# EAGLE design zeta2rework_lw_v9 (EAGLE 9.0.1)
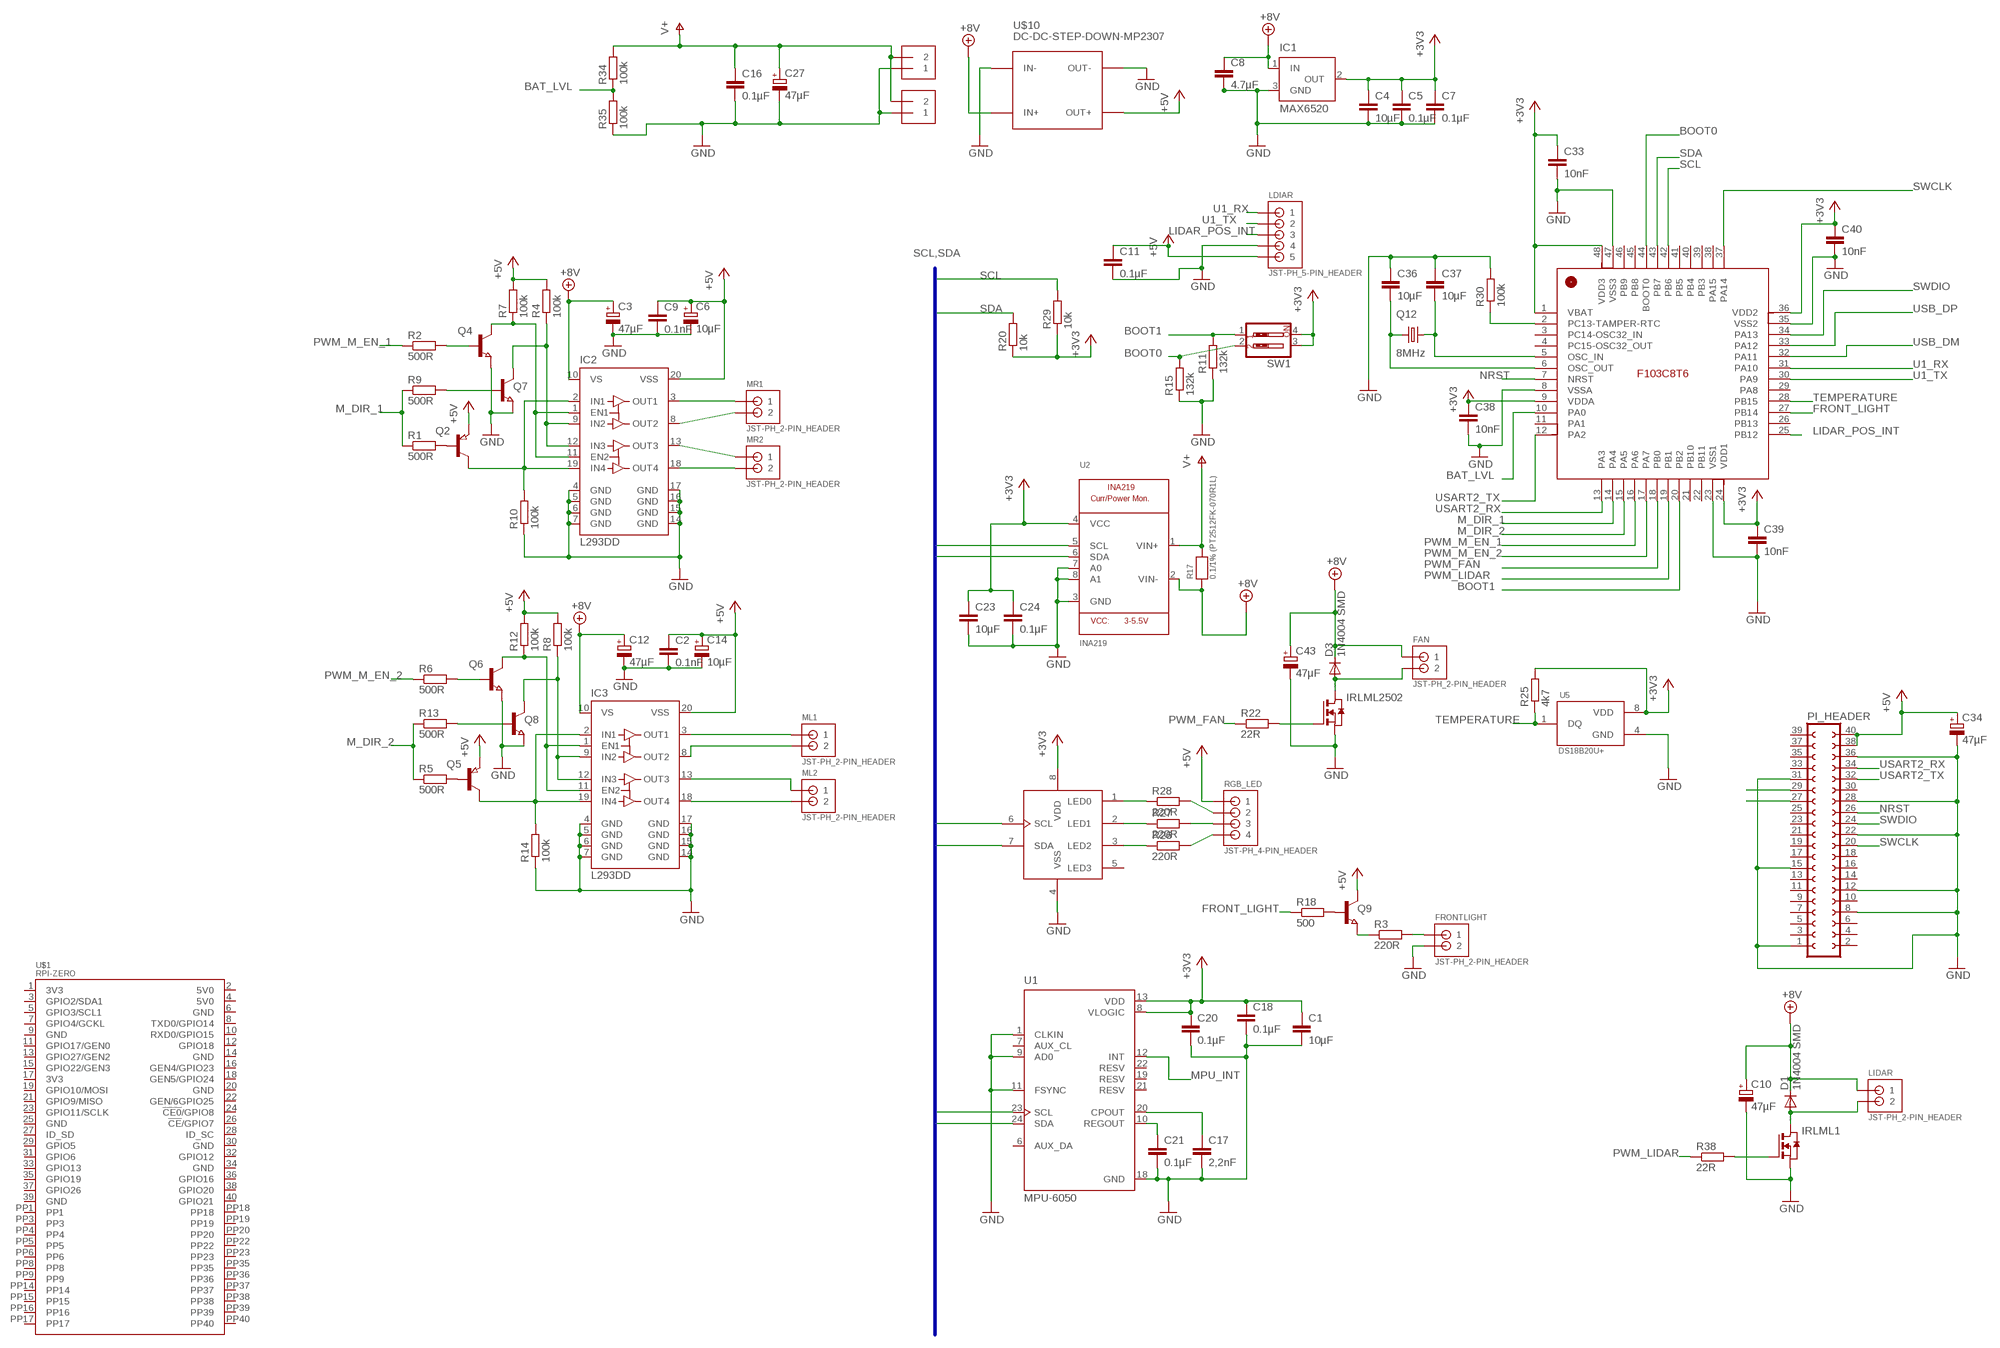
[diagram p0: schematic, sheet 1]

## Parts
C1  10µF  C-EUC1206  [C1206]
C2  0.1nF  C-EUC1206  [C1206]
C3  47µF  CPOL-EUUD-4X5,8  [UD-4X5,8_NICHICON]
C4  10µF  C-EUC1206  [C1206]
C5  0.1µF  C-EUC1206  [C1206]
C6  10µF  CPOL-EUUD-4X5,8  [UD-4X5,8_NICHICON]
C7  0.1µF  C-EUC1206  [C1206]
C8  4.7µF  C-EUC1206  [C1206]
C9  0.1nF  C-EUC1206  [C1206]
C10  47µF  CPOL-EUUD-4X5,8  [UD-4X5,8_NICHICON]
C11  0.1µF  C-EUC1206  [C1206]
C12  47µF  CPOL-EUUD-4X5,8  [UD-4X5,8_NICHICON]
C14  10µF  CPOL-EUUD-4X5,8  [UD-4X5,8_NICHICON]
C16  0.1µF  C-EUC1206  [C1206]
C17  2,2nF  C-EUC1206  [C1206]
C18  0.1µF  C-EUC1206  [C1206]
C20  0.1µF  C-EUC1206  [C1206]
C21  0.1µF  C-EUC1206  [C1206]
C23  10µF  C-EUC1206  [C1206]
C24  0.1µF  C-EUC1206  [C1206]
C27  47µF  CPOL-EUUD-4X5,8  [UD-4X5,8_NICHICON]
C33  10nF  C-EUC1206  [C1206]
C34  47µF  CPOL-EUUD-4X5,8  [UD-4X5,8_NICHICON]
C36  10µF  C-EUC1206  [C1206]
C37  10µF  C-EUC1206  [C1206]
C38  10nF  C-EUC1206  [C1206]
C39  10nF  C-EUC1206  [C1206]
C40  10nF  C-EUC1206  [C1206]
C43  47µF  CPOL-EUUD-4X5,8  [UD-4X5,8_NICHICON]
D1  1N4004 SMD  DIODE-DO214AC  [DO214AC]
D3  1N4004 SMD  DIODE-DO214AC  [DO214AC]
FAN  JST-PH_2-PIN_HEADER  [JST_B2B-PH_HEADER]
FRONTLIGHT  JST-PH_2-PIN_HEADER  [JST_B2B-PH_HEADER]
IC1  MAX6520  [SOT23]
IC2  L293DD  [SO20]
IC3  L293DD  [SO20]
IRLML1  NMOSSOT23  [SOT-23]
IRLML2502  NMOSSOT23  [SOT-23]
LDIAR  JST-PH_5-PIN_HEADER  [JST_B5B-PH_HEADER]
LIDAR  JST-PH_2-PIN_HEADER  [JST_B2B-PH_HEADER]
ML1  JST-PH_2-PIN_HEADER  [JST_B2B-PH_HEADER]
ML2  JST-PH_2-PIN_HEADER  [JST_B2B-PH_HEADER]
MR1  JST-PH_2-PIN_HEADER  [JST_B2B-PH_HEADER]
MR2  JST-PH_2-PIN_HEADER  [JST_B2B-PH_HEADER]
PCA9533  PCA9533  [SOIC8]
PI_HEADER  FE20-2  [FE20-2]
Q2  PNP-TRANSISTOR_SOT23  [SOT23]
Q4  NPN-TRANSISTOR_SOT23  [SOT23]
Q5  PNP-TRANSISTOR_SOT23  [SOT23]
Q6  NPN-TRANSISTOR_SOT23  [SOT23]
Q7  NPN-TRANSISTOR_SOT23  [SOT23]
Q8  NPN-TRANSISTOR_SOT23  [SOT23]
Q9  NPN-TRANSISTOR_SOT23  [SOT23]
Q12  8MHz  KX-13  [7.0X5.0]
R1  500R  R-EU_R0603  [R0603]
R2  500R  R-EU_R0603  [R0603]
R3  220R  R-EU_R0603  [R0603]
R4  100k  R-EU_R0603  [R0603]
R5  500R  R-EU_R0603  [R0603]
R6  500R  R-EU_R0603  [R0603]
R7  100k  R-EU_R0603  [R0603]
R8  100k  R-EU_R0603  [R0603]
R9  500R  R-EU_R0603  [R0603]
R10  100k  R-EU_R0603  [R0603]
R11  132k  R-EU_R0603  [R0603]
R12  100k  R-EU_R0603  [R0603]
R13  500R  R-EU_R0603  [R0603]
R14  100k  R-EU_R0603  [R0603]
R15  132k  R-EU_R0603  [R0603]
R17  0.1/1% (PT2512FK-070R1L)  RESISTOR2512  [2512]
R18  500  R-EU_R1206  [R1206]
R20  10k  R-EU_R0603  [R0603]
R22  22R  R-EU_R0603  [R0603]
R25  4k7  R-EU_R0603  [R0603]
R26  220R  R-EU_R0603  [R0603]
R27  220R  R-EU_R0603  [R0603]
R28  220R  R-EU_R0603  [R0603]
R29  10k  R-EU_R0603  [R0603]
R30  100k  R-EU_R0603  [R0603]
R34  100k  R-EU_R0603  [R0603]
R35  100k  R-EU_R0603  [R0603]
R38  22R  R-EU_R0603  [R0603]
RGB_LED  JST-PH_4-PIN_HEADER  [JST_B4B-PH_HEADER]
STM32F103CB  STM32F103CB  STM32F103C8T6  [LQFP48_7X7MM_0.5MMPP]
SUPPLY_IN  TERMBLOCK_1X2-3.5MM  [1X2-3.5MM]
SUPPLY_IN1  TERMBLOCK_1X2-3.5MM  [1X2-3.5MM]
SW1  SW_DIP-2  [EDG-02]
U1  MPU-6050  [QFN50P400X400X95-24N]
U2  INA219  [SOT23-8]
U5  DS18B20U+  [SOP65P490X95-8N]
U$1  RPI-ZERO  [RASP_PI_ZERO_BOARD_FULL]
U$10  DC-DC-STEP-DOWN-MP2307  [DC-DC-STEP-DOWN-MP2307]

## Nets
+3V3: C1.1 C4.1 C5.1 C7.1 C18.1 C20.1 C23.1 C24.1 C33.1 C38.1 C39.1 C40.1 IC1.2(OUT) PCA9533.8(VDD) R20.1 R25.2 R29.1 STM32F103CB.1(VBAT) STM32F103CB.9(VDDA) STM32F103CB.24(VDD1) STM32F103CB.36(VDD2) STM32F103CB.48(VDD3) SW1.3 SW1.4 U1.8(VLOGIC) U1.13(VDD) U2.4(VCC) U5.8(VDD)
+5V: C2.1 C6.+ C9.1 C11.1 C14.+ C34.+ IC2.20(VSS) IC3.20(VSS) LDIAR.P5 PI_HEADER.38 PI_HEADER.40 Q2.2(E) Q5.2(E) Q9.3(C) R4.2 R7.2 R8.2 R12.2 RGB_LED.P1 U$10.OUT+
+8V: C3.+ C8.1 C10.+ C12.+ C43.+ D1.C D3.C FAN.P1 IC1.1(IN) IC2.10(VS) IC3.10(VS) LIDAR.P1 R17.1 U2.2(VIN-) U$10.IN+
BAT_LVL: R34.1 R35.2 STM32F103CB.10(PA0)
BOOT0: R15.2 STM32F103CB.44(BOOT0) SW1.2
BOOT1: R11.2 STM32F103CB.20(PB2) SW1.1
BOOT2: PI_HEADER.29
BOOT3: PI_HEADER.27
FRONT_LIGHT: R18.1 STM32F103CB.27(PB14)
GND: C1.2 C2.2 C3.- C4.2 C5.2 C6.- C7.2 C8.2 C9.2 C10.- C11.2 C12.- C14.- C16.2 C17.2 C18.2 C20.2 C21.2 C23.2 C24.2 C27.- C33.2 C34.- C36.1 C37.1 C38.2 C39.2 C40.2 C43.- FRONTLIGHT.P2 IC1.3(GND) IC2.4(GND) IC2.5(GND) IC2.6(GND) IC2.7(GND) IC2.14(GND) IC2.15(GND) IC2.16(GND) IC2.17(GND) IC3.4(GND) IC3.5(GND) IC3.6(GND) IC3.7(GND) IC3.14(GND) IC3.15(GND) IC3.16(GND) IC3.17(GND) IRLML1.2(S) IRLML2502.2(S) LDIAR.P4 PCA9533.4(VSS) PI_HEADER.1 PI_HEADER.8 PI_HEADER.12 PI_HEADER.15 PI_HEADER.22 PI_HEADER.28 PI_HEADER.31 PI_HEADER.36 Q4.2(E) Q6.2(E) Q7.2(E) Q8.2(E) R10.1 R11.1 R14.1 R15.1 R30.2 R35.1 STM32F103CB.8(VSSA) STM32F103CB.23(VSS1) STM32F103CB.35(VSS2) STM32F103CB.47(VSS3) SUPPLY_IN1.1 SUPPLY_IN.1 U1.1(CLKIN) U1.9(AD0) U1.11(FSYNC) U1.18(GND) U2.3(GND) U2.7(A0) U2.8(A1) U5.4(GND) U$10.IN- U$10.OUT-
LIDAR_POS_INT: LDIAR.P3 STM32F103CB.25(PB12)
M_DIR_1: R1.1 R9.1 STM32F103CB.14(PA4)
M_DIR_2: R5.1 R13.1 STM32F103CB.15(PA5)
MPU_INT: U1.12(INT)
N$1: IC2.9(IN2) IC2.12(IN3) Q7.3(C) R4.1
N$2: IC3.18(OUT4) ML2.P2
N$3: IC3.13(OUT3) ML2.P1
N$4: IC2.18(OUT4) MR2.P2
N$5: IC2.2(IN1) IC2.19(IN4) Q2.3(C) R10.2
N$6: IC3.9(IN2) IC3.12(IN3) Q8.3(C) R8.1
N$7: IC3.2(IN1) IC3.19(IN4) Q5.3(C) R14.2
N$8: IC2.1(EN1) IC2.11(EN2) Q4.3(C) R7.1
N$9: IC3.1(EN1) IC3.11(EN2) Q6.3(C) R12.1
N$10: Q2.1(B) R1.2
N$11: Q4.1(B) R2.2
N$12: Q7.1(B) R9.2
N$13: Q5.1(B) R5.2
N$14: Q6.1(B) R6.2
N$15: Q8.1(B) R13.2
N$16: IC2.13(OUT3) MR2.P1
N$17: IC2.8(OUT2) MR1.P2
N$18: IC2.3(OUT1) MR1.P1
N$19: Q9.1(B) R18.2
N$22: PCA9533.3(LED2) R26.1
N$23: PCA9533.2(LED1) R27.1
N$24: PCA9533.1(LED0) R28.1
N$25: IC3.8(OUT2) ML1.P2
N$26: IC3.3(OUT1) ML1.P1
N$27: Q9.2(E) R3.1
N$28: FRONTLIGHT.P1 R3.2
N$31: R26.2 RGB_LED.P4
N$33: R27.2 RGB_LED.P3
N$34: C17.1 U1.20(CPOUT)
N$35: R28.2 RGB_LED.P2
N$36: C21.1 U1.10(REGOUT)
N$37: IRLML2502.3(G) R22.2
N$38: IRLML1.3(G) R38.2
N$39: D1.A IRLML1.1(D) LIDAR.P2
N$46: C36.2 Q12.1 STM32F103CB.6(OSC_OUT)
N$47: C37.2 Q12.3 STM32F103CB.5(OSC_IN)
N$49: R30.1 STM32F103CB.2(PC13-TAMPER-RTC)
N$55: D3.A FAN.P2 IRLML2502.1(D)
NRST: PI_HEADER.26 STM32F103CB.7(NRST)
PWM_FAN: R22.1 STM32F103CB.18(PB0)
PWM_LIDAR: R38.1 STM32F103CB.19(PB1)
PWM_M_EN_1: R2.1 STM32F103CB.16(PA6)
PWM_M_EN_2: R6.1 STM32F103CB.17(PA7)
SCL: PCA9533.6(SCL) R29.2 STM32F103CB.42(PB6) U1.23(SCL) U2.5(SCL)
SDA: PCA9533.7(SDA) R20.2 STM32F103CB.43(PB7) U1.24(SDA) U2.6(SDA)
SWCLK: PI_HEADER.20 STM32F103CB.37(PA14)
SWDIO: PI_HEADER.24 STM32F103CB.34(PA13)
TEMPERATURE: R25.1 STM32F103CB.28(PB15) U5.1(DQ)
U1_RX: LDIAR.P1 STM32F103CB.31(PA10)
U1_TX: LDIAR.P2 STM32F103CB.30(PA9)
USART2_RX: PI_HEADER.34 STM32F103CB.13(PA3)
USART2_TX: PI_HEADER.32 STM32F103CB.12(PA2)
USB_DM: STM32F103CB.32(PA11)
USB_DP: STM32F103CB.33(PA12)
V+: C16.1 C27.+ R17.2 R34.2 SUPPLY_IN1.2 SUPPLY_IN.2 U2.1(VIN+)
Unconnected: PCA9533.5(LED3) PI_HEADER.2 PI_HEADER.3 PI_HEADER.4 PI_HEADER.5 PI_HEADER.6 PI_HEADER.7 PI_HEADER.9 PI_HEADER.10 PI_HEADER.11 PI_HEADER.13 PI_HEADER.14 PI_HEADER.16 PI_HEADER.17 PI_HEADER.18 PI_HEADER.19 PI_HEADER.21 PI_HEADER.23 PI_HEADER.25 PI_HEADER.30 PI_HEADER.33 PI_HEADER.35 PI_HEADER.37 PI_HEADER.39 STM32F103CB.3(PC14-OSC32_IN) STM32F103CB.4(PC15-OSC32_OUT) STM32F103CB.11(PA1) STM32F103CB.21(PB10) STM32F103CB.22(PB11) STM32F103CB.26(PB13) STM32F103CB.29(PA8) STM32F103CB.38(PA15) STM32F103CB.39(PB3) STM32F103CB.40(PB4) STM32F103CB.41(PB5) STM32F103CB.45(PB8) STM32F103CB.46(PB9) U1.6(AUX_DA) U1.7(AUX_CL) U1.19(RESV) U1.21(RESV) U1.22(RESV) U$1.1(3V3) U$1.2(5V0) U$1.3(GPIO2/SDA1) U$1.4(5V0) U$1.5(GPIO3/SCL1) U$1.6(GND) U$1.7(GPIO4/GCKL) U$1.8(TXD0/GPIO14) U$1.9(GND) U$1.10(RXD0/GPIO15) U$1.11(GPIO17/GEN0) U$1.12(GPIO18) U$1.13(GPIO27/GEN2) U$1.14(GND) U$1.15(GPIO22/GEN3) U$1.16(GEN4/GPIO23) U$1.17(3V3) U$1.18(GEN5/GPIO24) U$1.19(GPIO10/MOSI) U$1.20(GND) U$1.21(GPIO9/MISO) U$1.22(GEN/6GPIO25) U$1.23(GPIO11/SCLK) U$1.24(!CE0!/GPIO8) U$1.25(GND) U$1.26(!CE!/GPIO7) U$1.27(ID_SD) U$1.28(ID_SC) U$1.29(GPIO5) U$1.30(GND) U$1.31(GPIO6) U$1.32(GPIO12) U$1.33(GPIO13) U$1.34(GND) U$1.35(GPIO19) U$1.36(GPIO16) U$1.37(GPIO26) U$1.38(GPIO20) U$1.39(GND) U$1.40(GPIO21) U$1.PP1 U$1.PP3 U$1.PP4 U$1.PP5 U$1.PP6 U$1.PP8 U$1.PP9 U$1.PP14 U$1.PP15 U$1.PP16 U$1.PP17 U$1.PP18 U$1.PP19 U$1.PP20 U$1.PP22 U$1.PP23 U$1.PP35 U$1.PP36 U$1.PP37 U$1.PP38 U$1.PP39 U$1.PP40

## Buses
SCL,SDA

## Library data of the parts
C1 C2 C4 C5 C7-C9 C11 C16-C18 C20 C21 C23 C24 C33 C36-C40 = rcl:C-EU: CAPACITOR, European symbol; SPICEPREFIX: C
C3 C6 C10 C12 C14 C27 C34 C43 = rcl:CPOL-EU: POLARIZED CAPACITOR, European symbol; SPICEPREFIX: C
D1 D3 = diode:DIODE-: DIODE
FAN FRONTLIGHT LIDAR ML1 ML2 MR1 MR2 = srg:JST-PH_2-PIN_HEADER: 2-pin JST PH Shrouded Header, top entry P/N B2B-PH-K-S Mating connector PHR-2 Mating cable assembly: Sparkfun PRT-09914 <http://www.sparkfun.com/products/9914>
IC1 = maxim:MAX6520: 1.2V Voltage Reference 50ppm/°C, SOT23, 3-Terminal Source: Data sheet <http://datasheets.maxim-ic.com/en/ds/MAX6520.pdf>; MF: MAXIM; MPN: MAX6520EUR-T; OC_FARNELL: unknown; OC_NEWARK: 02J4586
IC2 IC3 = st-microelectronics:L293DD: PUSH-PULL FOUR CHANNEL DRIVER WITH DIODES Source: http://www.st.com/stonline/books/pdf/docs/1330.pdf; OC_FARNELL: unknown
IRLML1 IRLML2502 = zetex:NMOSSOT23: MOS FET; OC_FARNELL: unknown; OC_NEWARK: unknown
LDIAR = srg:JST-PH_5-PIN_HEADER: 5-pin JST PH Shrouded Header, top entry P/N B5B-PH-K-S Mating connector PHR-5 Mating cable assembly: Sparkfun PRT-09917 <http://www.sparkfun.com/products/9917>
PCA9533 = adam - ics:PCA9533: PCA9533D/01: LED driver and dimmer 4 channel, PWM @ 8 bit resolution 25mA / channel sink external resistors per LED I2C protocol @ 400kHz (fast) digikey: 568-3372-5-ND, 8-SOIC, $1.92
PI_HEADER = con-lsta:FE20-2: FEMALE HEADER; OC_FARNELL: unknown; OC_NEWARK: unknown
Q2 Q5 = semicon-smd-ipc:PNP-TRANSISTOR_: PNP TRANSISTOR
Q4 Q6-Q9 = semicon-smd-ipc:NPN-TRANSISTOR_: NPN TRANSISTOR
Q12 = crystal-geyer_V1_0:KX: Quartz Crystals (MHz) SMD: KX - Serie Model Size l/w/h [mm] Frequency Range Frequency Stability Temp. Range [°C] Load Capacitance AECQ 200 availabel Datasheet KX-4 KX-5 KX-6 KX-7 KX-9A KX-9B KX-12A KX-12B KX-13 KX-20 KX-K KX-KS 1.6/1.2/0.3 2.0/1.6/0.45 2.5/2.0/0.55 3.2/2.5/0.8 5.0/3.2/1.0 5.0/3.2/1.1 6.0/3.5/1.1 6.0/3.5/1.0 7.0/5.0 /1.3 11.6/5.5/1.6 12.3/4.5/4.2 12.3/4.5/3.2 24.0 ~ 80.0 MHz 16.0 ~ 80.0 MHz 12.0 ~ 80.0 MHz 8.0 ~ 60.0 MHz 7,68 ~ 300,0 MHz 8,0 ~ 50,0 MHz 8,0 ~ 150,0 MHz 8,0 ~ 50,0 MHz 6,0 ~ 160,0 MHz 3,579 ~ 25,0 MHz 3,579 ~ 70,0 MHz 3,579 ~ 70,0 MHz ±10 … ±50ppm ±10 … ±50ppm ±10 … ±50ppm ±10 … ±50ppm ±10 … ±50ppm ±10 … ±50ppm ±10 … ±50ppm ±10 … ±50ppm ±10 … ±50ppm ±50ppm ±10 … ±50ppm ±10 … ±50ppm (*) -40°C …+85°C (*) -40°C …+125°C (*) -40°C …+125°C (*) -40°C …+125°C (*) -40°C …+105°C (*) -40°C …+105°C (*) -40°C …+125°C (*) -40°C …+105°C (*) -40°C …+105°C (*) -40°C …+105°C (*) -40°C …+85°C (*) -40°C …+85°C 8, 8…16 8, 8…16 10, 8…16 12, 7…20 16, 10…20 16, 10…20 16, 10…20 16, 12…20 16, 12…20 16, 12…20 16, 12…30 16, 12…30 - yes yes yes - - - - - - - - KX-4.pdf <http://www.geyer-electronic.de/uploads/tx_userartikelfrequenz/GEYER-KX-4.pdf> KX-5.pdf <http://www.geyer-electronic.de/uploads/tx_userartikelfrequenz/GEYER-KX-5.pdf> KX-6.pdf <http://www.geyer-electronic.de/uploads/tx_userartikelfrequenz/GEYER-KX-6.pdf> KX-7.pdf <http://www.geyer-electronic.de/uploads/tx_userartikelfrequenz/GEYER-KX-7.pdf> KX-9A.pdf <http://www.geyer-electronic.de/uploads/tx_userartikelfrequenz/GEYER-KX-9A.pdf> KX-9B.pdf <http://www.geyer-electronic.de/uploads/tx_userartikelfrequenz/GEYER-KX-9B.pdf> KX-12A.pdf <http://www.geyer-electronic.de/uploads/tx_userartikelfrequenz/GEYER-KX-12A.pdf> KX-12B.pdf <http://www.geyer-electronic.de/uploads/tx_userartikelfrequenz/GEYER-KX-12B.pdf> KX-13.pdf <http://www.geyer-electronic.de/uploads/tx_userartikelfrequenz/GEYER-KX-13.pdf> KX-20.pdf <http://www.geyer-electronic.de/uploads/tx_userartikelfrequenz/GEYER-KX-20.pdf> KX-K.pdf <http://www.geyer-electronic.de/uploads/tx_userartikelfrequenz/GEYER-KX-K.pdf> KX-KS.pdf <http://www.geyer-electronic.de/uploads/tx_userartikelfrequenz/GEYER-KX-KS.pdf> <http://www.geyer-electronic.de/fileadmin/template/img/logo-geyer-electronic.png> Details see: http://www.geyer-electronic.de/Frequenz-Produkte.9.0.html Created 2016-06-07, Hans Locher 2016 (C) Geyer Quartz Technology KX4,KX5,KX6,KX7,KX9A,KX9B,KX12A,KX12B,KX13,KX20,KXK,KXKS;1612;2016;2520;3225;5032;6035;7050;11655;12345;1,6x1,2;2,0x1,6;2,5x2,0;3,2x2,5;5,0x3,2;6,0x3,5;7,0x5,0;11,6x5,5;12,3x4,5;12,3x4,5;1.6x1.2;2.0x1.6;2.5x2.0;3.2x2.5;5.0x3.2;6.0x3.5;7.0x5.0;11.6x5.5;12.3x4.5;12.3x4.5;
R1-R15 R18 R20 R22 R25-R30 R34 R35 R38 = rcl:R-EU_: RESISTOR, European symbol; SPICEPREFIX: R
R17 = microbuilder:RESISTOR: Resistors 0402 - 0402 Surface Mount Package 22 Ohm 1% 1/16W [Digikey: 311-22.0LRTR-ND] 33 Ohm 5% 1/16W 1.0K 5% 1/16W 1.5K 5% 1/16W 2.0K 1% 1/16W 10.0K 1% 1/16W [Digikey: 311-10.0KLRTR-ND] 10.0K 5% 1/16W [Digikey: RMCF0402JT10K0TR-ND] 12.1K 1% 1/16W [Digikey: 311-22.0LRTR-ND] 100.0K 5% 1/16W 0603 - 0603 Surface Mount Package 0 Ohm 1/10 Watt 1% Resistor 15 Ohm 1/10 Watt 1% Resistor 33 Ohm 1/10 Watt 1% Resistor 49.9 Ohm 1/10 Watt 1% Resistor 100 Ohm 1/10 Watt 1% Resistor 150 Ohm 1/10 Watt 1% Resistor 240 Ohm 1/10 Watt 1% Resistor 390 Ohm 1/10 Watt 1% Resistor 560 Ohm 1/10 Watt 1% Resistor 680 Ohm 1/10 Watt 1% Resistor 750 Ohm 1/10 Watt 1% Resistor 1.0K Ohm 1/10 Watt 1% Resistor 1.5K Ohm 1/10 Watt 1% Resistor 2.0K Ohm 1/10 Watt 1% Resistor 2.2K Ohm 1/10 Watt 1% Resistor 3.3K Ohm 1/10 Watt 1% Resistor 4.7K Ohm 1/10 Watt 1% Resistor 10.0K Ohm 1/10 Watt 1% Resistor 12.0K Ohm 1/10 Watt 1% Resistor 12.1K Ohm 1/10 Watt 1% Resistor 20.0K Ohm 1/10 Watt 1% Resistor 33.0K Ohm 1/10 Watt 1% Resistor 100.0K Ohm 1/10 Watt 1% Resistor 0805 - 0805 Surface Mount Package 0 Ohm 1/8 Watt 1% Resistor 33 Ohm 1/8 Watt 1% Resistor 100 Ohm 1/8 Watt 1% Resistor 150 Ohm 1/8 Watt 1% Resistor 200 Ohm 1/8 Watt 1% Resistor 240 Ohm 1/8 Watt 1% Resistor 330 Ohm 1/8 Watt 1% Resistor 390 Ohm 1/8 Watt 1% Resistor 470 Ohm 1/8 Watt 1% Resistor 1.0K Ohm 1/8 Watt 1% Resistor 1.5K Ohm 1/8 Watt 1% Resistor 2.0K Ohm 1/8 Watt 1% Resistor 4.7K Ohm 1/8 Watt 1% Resistor 5.1K Ohm 1/8 Watt 1% Resistor 5.6K Ohm 1/8 Watt 1% Resistor 10.0K Ohm 1/8 Watt 1% Resistor 22.0K Ohm 1/8 Watt 1% Resistor 33.0K Ohm 1/8 Watt 1% Resistor 100K Ohm 1/8 Watt 1% Resistor 1206 - 1206 Surface Mount Package 2012 - 2010 Surface Mount Package 0.11 Ohm 1/2 Watt 1% Resistor - Digikey: RHM.11UCT-ND
RGB_LED = srg:JST-PH_4-PIN_HEADER: 4-pin JST PH Shrouded Header, top entry P/N B4B-PH-K-S Mating connector PHR-4 Mating cable assembly: Sparkfun PRT-09916 <http://www.sparkfun.com/products/9916>
STM32F103CB = STM32F103C8T6:STM32F103C8T6; AVAILABILITY: Good; DESCRIPTION: Mainstream Performance line, ARM Cortex-M3 MCU with 64 Kbytes Flash, 72 MHz CPU, motor control, USB and CAN; MF: STMicroelectronics; MP: STM32F103C8T6; PACKAGE: LQFP-48 STMicroelectronics; PRICE: 3.83 USD
SUPPLY_IN SUPPLY_IN1 = microbuilder:TERMBLOCK_1X2: 3.5mm Terminal block http://www.ladyada.net/library/pcb/eaglelibrary.html
SW1 = special:SW_DIP-2: DIP SWITCH
U1 = MPU-6050:MPU-6050: MPU-6050 Six-Axis (Gyro + Accelerometer) MEMS MotionTracking™ Devices; AVAILABILITY: Good; DESCRIPTION: 3-axis gyroscope, 3-axis accelerometer in a 4x4x0.9 housing; MF: TDK; MP: MPU-6050; PACKAGE: QFN-24 InvenSense; PRICE: 5.12 USD
U2 = INA219:INA219: INA219 - I2C Current/Power Monitor Voltage Range: 0-26V Accuracy: 0.5% Temperature: -40°C - 125°C; AVAILABILITY: Unavailable; DESCRIPTION: the ina219 is a high-side current shunt and power monitor with an i2c interface. the ina219 monitors both shunt drop ...; MF: Texas Instruments; MP: INA219; PACKAGE: None; PRICE: None
U5 = DS18B20U_:DS18B20U+: Board Mount Temperature Sensors Prgmble Resolution 1-Wire Parasite Pwr; AVAILABILITY: Unavailable; DESCRIPTION: Date Code: 1043+; RoHS Compliant: Yes;; MF: Maxim; MP: DS18B20U+; PACKAGE: TSSOP-8 Chip Coolers; PRICE: None
U$1 = rpi-zero:RPI-ZERO
U$10 = diy-modules:DC-DC-STEP-DOWN-MP2307: DC/DC Step-Down Regulator based on MP2307DN chip MP2307 datasheet available here: https://cdn-shop.adafruit.com/datasheets/MP2307_r1.9.pdf Click here to find device on ebay.com <http://www.ebay.com/sch/dc+dc+3a+mini+converter>

## Board
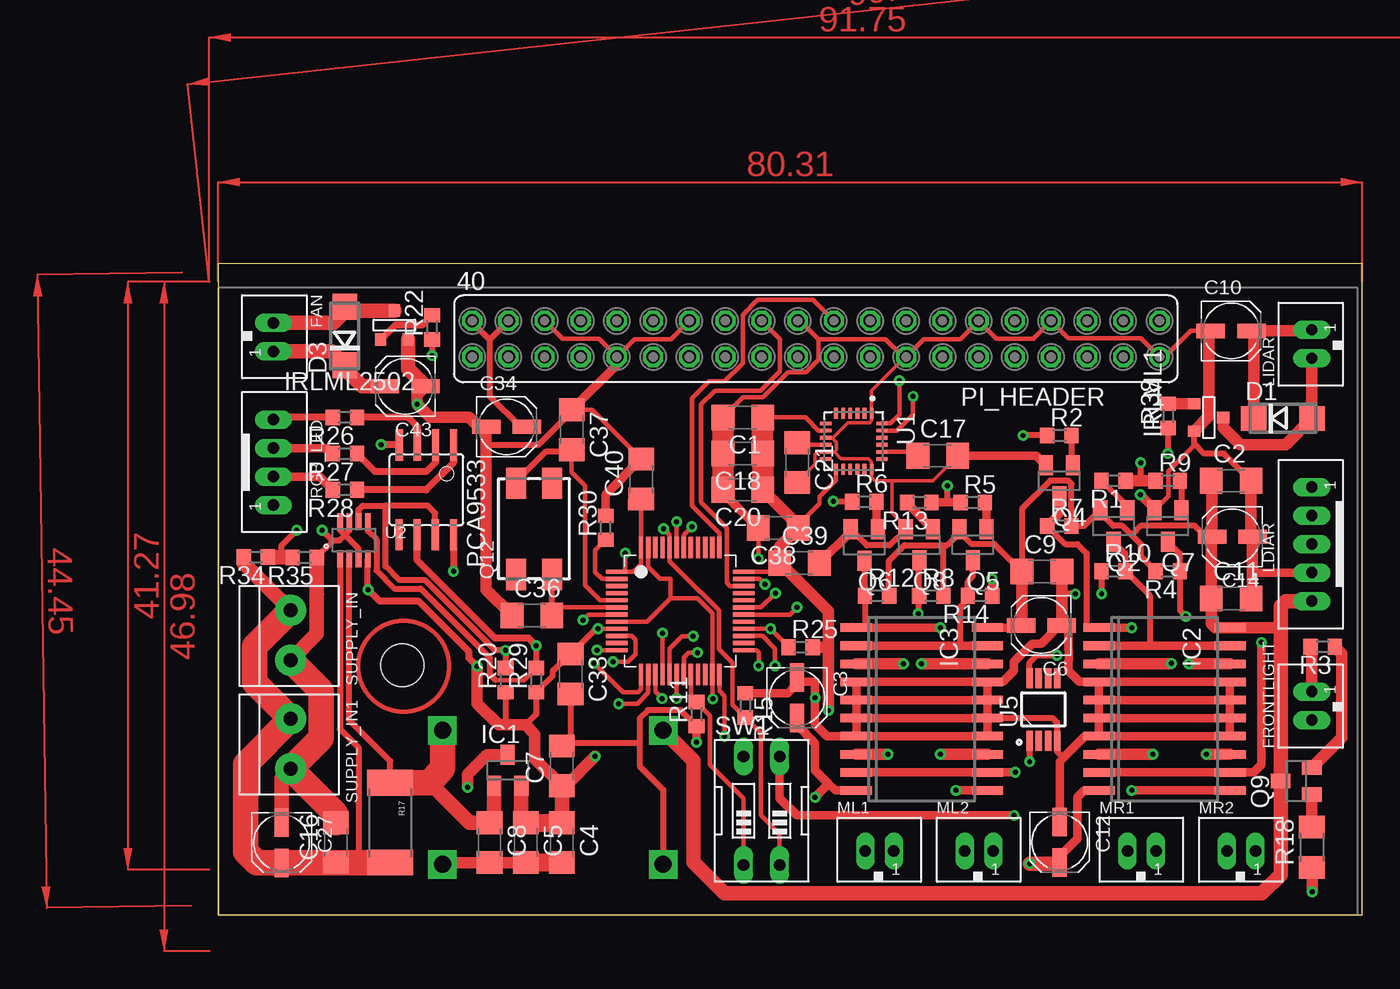
[diagram p1: board, top side]
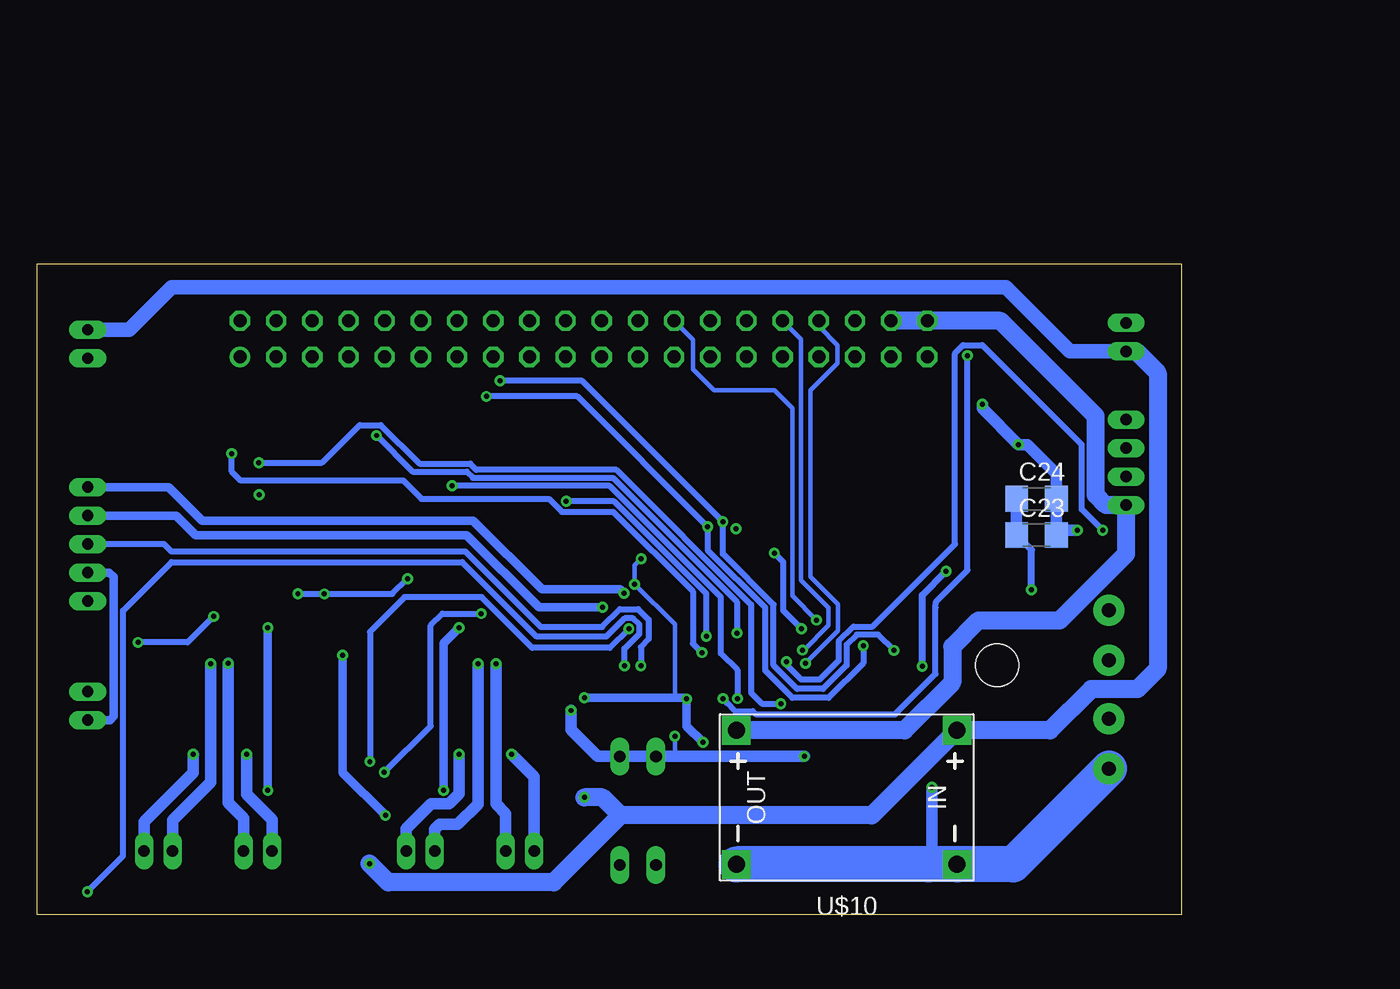
[diagram p2: board, bottom side, seen from below]

Size 80.31 x 45.71 mm. Coordinates in mm from the lower left corner, seen from the top.
Outline: 0,0 80.31,0 80.31,45.71 0,45.71 0,0
Copper layers (1*16): Top 0.035mm / dielectric 1.5mm / Bottom 0.035mm
Design rules "default": minimum track width 6mil, minimum drill 0.35mm, track to track 6mil, track to pad 6mil, pad to pad 6mil, via to via 6mil, smd to smd 6mil, copper to edge 40mil, drill to drill 6mil, minimum pad ring 10mil, minimum via ring 8mil, stop-mask expansion 4mil, vias tented up to drill 0mil, thermal gap 10mil
Holes 3 mm at 12.93,17.53

### Footprints (pad centres in the part's own frame; a part is rotated, then mirrored left to right if it is on the bottom)
C1206 = smd 1.6 x 1.8: 1 -1.4,0; 2 1.4,0
UD-4X5,8_NICHICON = smd 2 x 1: + 1.425,0; - -1.425,0
DO214AC = smd 1.8 x 1.7: A 2.05,0; C -2.05,0
JST_B2B-PH_HEADER = drill 0.8 long: P1 1.075,0.048; P2 -0.925,0.048
SOT23 = smd 1 x 1.4: 1 -0.95,-1.1; 2 0.95,-1.1; 3 0,1.1
SO20 = smd 0.6 x 2.2: 1 -5.715,-4.6; 2 -4.445,-4.6; 3 -3.175,-4.6; 4 -1.905,-4.6; 5 -0.635,-4.6; 6 0.635,-4.6; 7 1.905,-4.6; 8 3.175,-4.6; 9 4.445,-4.6; 10 5.715,-4.6; 11 5.715,4.6; 12 4.445,4.6; 13 3.175,4.6; 14 1.905,4.6; 15 0.635,4.6; 16 -0.635,4.6; 17 -1.905,4.6; 18 -3.175,4.6; 19 -4.445,4.6; 20 -5.715,4.6
SOT-23 = smd 0.787 x 0.889: 1 0.025,-1.016; 2 -0.94,1.016; 3 0.991,1.016
JST_B5B-PH_HEADER = drill 0.8 long: P1 4,0.048; P2 2,0.048; P3 0,0.048; P4 -2,0.048; P5 -4,0.048
SOIC8 = smd 0.5 x 2.2: 1 -1.905,-3.154; 2 -0.645,-3.154; 3 0.625,-3.154; 4 1.895,-3.154; 5 1.905,3.154; 6 0.635,3.154; 7 -0.635,3.154; 8 -1.905,3.154
FE20-2 = drill 0.914: 1 -24.13,1.27 | drill 0.914 octagon: 2 -24.13,-1.27; 3 -21.59,1.27; 4 -21.59,-1.27; 5 -19.05,1.27; 6 -19.05,-1.27; 7 -16.51,1.27; 8 -16.51,-1.27; 9 -13.97,1.27; 10 -13.97,-1.27; 11 -11.43,1.27; 12 -11.43,-1.27; 13 -8.89,1.27; 14 -8.89,-1.27; 15 -6.35,1.27; 16 -6.35,-1.27; 17 -3.81,1.27; 18 -3.81,-1.27; 19 -1.27,1.27; 20 -1.27,-1.27; 21 1.27,1.27; 22 1.27,-1.27; 23 3.81,1.27; 24 3.81,-1.27; 25 6.35,1.27; 26 6.35,-1.27; 27 8.89,1.27; 28 8.89,-1.27; 29 11.43,1.27; 30 11.43,-1.27; 31 13.97,1.27; 32 13.97,-1.27; 33 16.51,1.27; 34 16.51,-1.27; 35 19.05,1.27; 36 19.05,-1.27; 37 21.59,1.27; 38 21.59,-1.27; 39 24.13,1.27; 40 24.13,-1.27
7.0X5.0 = smd 2.2 x 1.4: 1 -3.2,-1.25; 2 3.2,-1.25; 3 3.2,1.25; 4 -3.2,1.25
R0603 = smd 1 x 1.1: 1 -0.85,0; 2 0.85,0
2512 = smd 1.8 x 3.2: 1 -2.8,0; 2 2.8,0
R1206 = smd 1.6 x 1.803: 1 -1.422,0; 2 1.422,0
JST_B4B-PH_HEADER = drill 0.8 long: P1 2.98,0.048; P2 0.98,0.048; P3 -1.02,0.048; P4 -3.02,0.048
LQFP48_7X7MM_0.5MMPP = smd 1.5 x 0.3: 1 -4.45,2.75; 2 -4.45,2.25; 3 -4.45,1.75; 4 -4.45,1.25; 5 -4.45,0.75; 6 -4.45,0.25; 7 -4.45,-0.25; 8 -4.45,-0.75; 9 -4.45,-1.25; 10 -4.45,-1.75; 11 -4.45,-2.25; 12 -4.45,-2.75; 25 4.45,-2.75; 26 4.45,-2.25; 27 4.45,-1.75; 28 4.45,-1.25; 29 4.45,-0.75; 30 4.45,-0.25; 31 4.45,0.25; 32 4.45,0.75; 33 4.45,1.25; 34 4.45,1.75; 35 4.45,2.25; 36 4.45,2.75 | smd 0.3 x 1.5: 13 -2.75,-4.45; 14 -2.25,-4.45; 15 -1.75,-4.45; 16 -1.25,-4.45; 17 -0.75,-4.45; 18 -0.25,-4.45; 19 0.25,-4.45; 20 0.75,-4.45; 21 1.25,-4.45; 22 1.75,-4.45; 23 2.25,-4.45; 24 2.75,-4.45; 37 2.75,4.45; 38 2.25,4.45; 39 1.75,4.45; 40 1.25,4.45; 41 0.75,4.45; 42 0.25,4.45; 43 -0.25,4.45; 44 -0.75,4.45; 45 -1.25,4.45; 46 -1.75,4.45; 47 -2.25,4.45; 48 -2.75,4.45
1X2-3.5MM = drill 1 pad 2.184: 1 1.8,0; 2 -1.7,0
EDG-02 = drill 0.813 long: 1 -1.27,-3.81; 2 1.27,-3.81; 3 1.27,3.81; 4 -1.27,3.81
QFN50P400X400X95-24N = smd 0.79 x 0.26: 1 -1.97,1.25; 2 -1.97,0.75; 3 -1.97,0.25; 4 -1.97,-0.25; 5 -1.97,-0.75; 6 -1.97,-1.25; 13 1.97,-1.25; 14 1.97,-0.75; 15 1.97,-0.25; 16 1.97,0.25; 17 1.97,0.75; 18 1.97,1.25 | smd 0.26 x 0.79: 7 -1.25,-1.97; 8 -0.75,-1.97; 9 -0.25,-1.97; 10 0.25,-1.97; 11 0.75,-1.97; 12 1.25,-1.97; 19 1.25,1.97; 20 0.75,1.97; 21 0.25,1.97; 22 -0.25,1.97; 23 -0.75,1.97; 24 -1.25,1.97
SOT23-8 = smd 0.4 x 1.2: 1 -0.975,-1.3; 2 -0.325,-1.3; 3 0.325,-1.3; 4 0.975,-1.3; 5 0.975,1.3; 6 0.325,1.3; 7 -0.325,1.3; 8 -0.975,1.3
SOP65P490X95-8N = smd 1.4 x 0.45: 1 -2.2,0.975; 2 -2.2,0.325; 3 -2.2,-0.325; 4 -2.2,-0.975; 5 2.2,-0.975; 6 2.2,-0.325; 7 2.2,0.325; 8 2.2,0.975
RASP_PI_ZERO_BOARD_FULL = drill 1 pad 1.778 square: 1 8.37,25.23 | drill 1 pad 1.778: 2 8.37,27.77; 3 10.91,25.23; 4 10.91,27.77; 5 13.45,25.23; 6 13.45,27.77; 7 15.99,25.23; 8 15.99,27.77; 9 18.53,25.23; 10 18.53,27.77; 11 21.07,25.23; 12 21.07,27.77; 13 23.61,25.23; 14 23.61,27.77; 15 26.15,25.23; 16 26.15,27.77; 17 28.69,25.23; 18 28.69,27.77; 19 31.23,25.23; 20 31.23,27.77; 21 33.77,25.23; 22 33.77,27.77; 23 36.31,25.23; 24 36.31,27.77; 25 38.85,25.23; 26 38.85,27.77; 27 41.39,25.23; 28 41.39,27.77; 29 43.93,25.23; 30 43.93,27.77; 31 46.47,25.23; 32 46.47,27.77; 33 49.01,25.23; 34 49.01,27.77; 35 51.55,25.23; 36 51.55,27.77; 37 54.09,25.23; 38 54.09,27.77; 39 56.63,25.23; 40 56.63,27.77 | drill 0.8 pad 1.778: PP1 10.699,4.832; PP3 7.593,8.858; PP4 7.133,14.38; PP5 55.796,23.124; PP6 10.699,2.301; PP8 5.177,8.858; PP9 9.549,14.38; PP14 58.327,18.407; PP15 55.796,14.265; PP16 55.796,20.363; PP17 58.212,21.743; PP18 55.796,17.027; PP19 58.327,15.186; PP20 56.832,9.434; PP35 17.257,2.416; PP36 60.628,12.425; PP37 56.026,2.071; PP38 53.726,2.416; PP39 58.097,12.54; PP40 18.867,6.212 | drill 0.8 pad 1.422: PP22 23.009,2.071; PP23 24.734,2.071 | hole 2.75: 3.5,3.5; 3.5,26.5; 61.5,3.5; 61.5,26.5
DC-DC-STEP-DOWN-MP2307 = drill 1.2 pad 2 square: IN+ -7.747,-4.699; IN- -7.747,4.699; OUT+ 7.747,-4.699; OUT- 7.747,4.699

### Placement (x,y rotation side)
C1  36.83,34.92 180 top
C2  71.12,30.48 0 top
C3  40.64,15.24 270 top
C4  24.13,5.08 270 top
C5  21.59,5.08 270 top
C6  57.78,20.32 180 top
C7  24.13,10.46 90 top
C8  19.05,5.08 270 top
C9  57.84,24.1 0 top
C10  71.12,41 0 top
C11  71.12,22.23 0 top
C12  59.08,5.11 270 top
C14  71.2,26.54 180 top
C16  8.26,5.08 90 top
C17  50.52,32.23 0 top
C18  36.83,32.38 180 top
C20  36.83,29.84 180 top
C21  40.64,31.75 270 top
C23  10.16,26.67 0 bottom
C24  10.16,29.21 0 bottom
C27  4.45,5.08 270 top
C33  24.74,16.92 270 top
C34  20.24,34.26 0 top
C36  22.02,21.03 0 top
C37  24.82,34.06 270 top
C38  39.32,27.15 180 top
C39  40.82,24.71 0 top
C40  29.69,30.61 89.8 top
C43  13.13,37.11 180 top
D1  74.75,34.85 0 top
D3  8.89,40.64 90 top
FAN  3.81,40.64 270 top
FRONTLIGHT  76.83,14.61 90 top
IC1  20.32,10.16 0 top
IC2  66.45,14.45 270 top
IC3  49.4,14.45 270 top
IRLML1  69.55,34.9 90 top
IRLML2502  12.4,41.4 180 top
LDIAR  76.83,26.04 90 top
LIDAR  76.83,40.01 90 top
ML1  46.35,4.44 0 top
ML2  53.34,4.44 0 top
MR1  64.77,4.44 0 top
MR2  71.75,4.44 0 top
PCA9533  14.61,29.84 180 top
PI_HEADER  41.96,40.44 180 top
Q2  62.87,27.3 180 top
Q4  59.05,30.48 180 top
Q5  52.98,25.98 180 top
Q6  45.36,25.96 180 top
Q7  66.67,27.3 180 top
Q8  49.23,25.98 180 top
Q9  75.69,9.4 90 top
Q12  22.17,27.1 90 top
R1  62.87,30.48 180 top
R2  59.05,33.66 0 top
R3  77.55,18.82 180 top
R4  66.67,24.13 180 top
R5  52.98,28.96 0 top
R6  45.36,29.01 0 top
R7  59.05,27.3 0 top
R8  50.06,22.4 0 top
R9  66.67,30.48 0 top
R10  62.87,24.13 0 top
R11  33.58,14.1 90 top
R12  46.25,22.4 0 top
R13  49.23,28.96 180 top
R14  53.49,22.4 180 top
R15  37.01,14.71 270 top
R17  12.06,6.48 270 top
R18  76.78,4.75 90 top
R20  20.17,16.48 90 top
R22  15.01,41.25 90 top
R25  40.89,18.8 0 top
R26  8.89,34.92 180 top
R27  8.89,32.38 180 top
R28  8.89,29.84 180 top
R29  22.33,16.48 90 top
R30  27.2,27.18 90 top
R34  2.64,25.12 180 top
R35  6.07,25.1 180 top
R38  66.7,35.03 90 top
RGB_LED  3.81,31.75 270 top
STM32F103CB  32.44,21.34 0 top
SUPPLY_IN  5.08,19.69 270 top
SUPPLY_IN1  5.08,12.07 270 top
SW1  38.15,7.32 0 top
U1  44.63,33.25 270 top
U2  9.53,26.31 0 top
U5  57.94,14.43 90 top
U$1  -10.79,-45.72 0 top  (outside the outline)
U$10  23.5,8.25 180 bottom

### Tracks (layer width: path | path; a pad name or v marks a point on that pad's centre or on a via)
+3V3  (via drill 0.35)
  Top 0.305: U1.8 42.15,34 41.22,34.92 C1.1 | STM32F103CB.24 35.19,15.74 35.56,15.37 v35.56,12.55 | STM32F103CB.1 28.57,24.09 | 28.57,24.09 29.17,24.09 29.69,24.61 STM32F103CB.48 C40.1 | STM32F103CB.36 38.79,24.09 C39.1 | U1.13 43.38,30.52 42.22,29.36 42.22,28.85 40.72,27.36 C38.1 | STM32F103CB.9 v26.67,20.09 | v28.57,25.4 28.57,24.09
  Top 0.406: U5.8 56.96,17.72 57.48,18.24 v58.88,18.24 | 24.49,17.84 C33.1 | 25.12,18.32 C33.1 | R20.1 20.17,13.49 20.32,13.34 | 21.59,13.34 22.33,14.07 R29.1 23.5,16.8 23.5,17.14 24.67,18.32 C33.1 | 24.79,18.32 C33.1 | v10.52,22.84 10.5,22.85 U2.4 | C33.1 26.51,20.09 v26.67,20.09
  Top 0.508: PCA9533.8 v16.51,24.13 | v10.52,22.84 11.3,22.05 14.02,22.05 17.6,18.47 17.6,18.03 v18.19,17.45
  Top 0.61: SW1.3 39.42,8.2 40.64,6.99 v55.88,6.99
  Top 0.813: C7.1 23.73,8.66 | C7.1 22.23,10.97 22.23,12.7 21.59,13.34 20.32,13.34 19.68,13.34 18.19,14.83 v18.19,17.45 | v26.47,11.12 24.41,9.07 C7.1 | C20.1 40.72,27.36 C38.1 39.42,25.85 C39.1 39.45,24.71 42.85,21.32 42.85,18.8 | v42.85,14.35 42.85,18.8 | R25.2 42.85,18.8
  Top 1.016: IC1.2 21.27,6.8 C5.1 | C7.1 C4.1
  Top 1.27: C5.1 C4.1
  Top 1.524: C20.1 38.26,30.96 C18.1 C1.1
  Bottom 0.305: 35.71,11.28 35.56,11.12 v35.56,12.55 | 34.75,11.3 34.92,11.12
  Bottom 0.406: v26.67,20.09 27.94,21.36 27.94,24.77 v28.57,25.4
  Bottom 0.508: v10.52,22.84 10.52,25.63 C23.1 | v18.19,17.45 18.19,22.45 v16.51,24.13
  Bottom 0.61: v58.88,18.24 58.88,9.98 v55.88,6.99
  Bottom 0.813: v26.47,11.12 34.92,11.12 35.56,11.12 SW1.4 SW1.3 40.97,11.12 42.85,13 v42.85,14.35 | C24.1 C23.1
+5V
  Top 0.305: 52.03,26.81 52.03,26.88
  Top 0.406: R12.2 47.1,24.88 48.18,25.96 50.8,25.96 | 52.03,26.81 51.19,25.96 50.8,25.96 | R8.2 50.91,25.84 50.8,25.96 | 19.05,40.39 PI_HEADER.38 | 19.05,40.39 17.83,41.61 PI_HEADER.40 | R4.2 64.77,25.19 64.77,26.04 64.14,26.67 | 64.14,26.67 63.5,27.3 62.87,27.3 61.91,28.26 Q2.2 60.81,27.3 R7.2 59.91,28.53 59.91,30.26 59.69,30.48 58.42,30.48 56.44,28.5 C9.1 54.51,26.03 52.89,26.03 52.03,26.88 Q5.2 | 64.14,26.67 64.77,27.3 68.58,27.3 69.34,26.54 C14.+ | C34.+ 21.21,34.27 19.05,36.42 19.05,40.39
  Top 0.61: IC3.20 56.21,20.17 C6.+
  Top 0.813: C6.+ 56.44,20.4 C9.1 | C2.1 69.77,30.43 C14.+ 69.72,26.49 C11.1 69.72,20.45 70,20.17 IC2.20 74.44,20.17 74.59,20.32
  Top 1.016: U$10.OUT+ 33.38,10.82 33.38,3.71 35.56,1.52 73.28,1.52 74.59,2.84 Q9.3 74.59,20.32 74.59,21.66 74.97,22.04 LDIAR.P5
  Bottom 1.27: PI_HEADER.38 PI_HEADER.40 12.69,41.71 5.99,35.01 5.99,29.49 5.28,28.77 RGB_LED.P1 3.86,25.35 8.53,20.68 14.23,20.68 16.08,18.83 16.08,16.3 19.43,12.95 U$10.OUT+
+8V  (via drill 0.35)
  Top 0.406: 10.85,8.94 10.79,8.89 11.68,8.89 R17.1 12.06,10.8 9.2,13.66 U2.2
  Top 0.61: IC2.10 60.81,8.74 60.33,8.25 60.33,5.36 59.08,4.11 C12.+ | IC3.10 43.33,8.74 42.86,9.21 | C3.+ 40.64,13.34 41.91,12.07 41.91,10.16 42.86,9.21 | v41.91,8.25 42.86,9.21
  Top 0.813: LIDAR.P1 76.7,41 C10.+ 72.7,40.84 D1.C
  Top 1.016: C43.+ 10.09,37.11 8.89,38.31 D3.C 7.94,39.56 FAN.P1 | IC1.1 19.37,6.8 C8.1 17.65,6.48 14.85,9.28 | 59.08,3.2 C12.+ 59.01,3.61 v57,3.61
  Top 1.778: R17.1 14.85,9.28 15.75,10.29 U$10.IN+
  Bottom 1.016: LIDAR.P1 73.86,41.08 70.88,44.06 12.31,44.06 7.82,39.56 FAN.P1
  Bottom 1.27: 39.37,6.99 44.07,2.29 55.68,2.29 v57,3.61 | 39.37,6.99 40.64,8.25 v41.91,8.25 | 39.37,6.99 21.72,6.99 U$10.IN+ 9.22,12.95 6.33,15.85 3.07,15.85 1.65,17.27 1.65,38.05 3.17,39.56 FAN.P1
BAT_LVL  (via drill 0.35)
  Top 0.305: STM32F103CB.10 29,19.59 29.29,19.3 29.29,18.29 28.78,17.78 v27.71,17.78
  Top 0.406: 4.45,25.12 4.45,25.93 v5.51,27
  Top 1.016: R34.1 4.45,25.12 5.2,25.12 R35.2
  Bottom 0.406: v27.71,17.78 27.71,17.55 26.67,16.51 25.4,16.51 24.05,17.86 24.05,19.2 23.01,20.24 21.67,20.24 20.64,21.27 17.78,24.13 15.88,26.04 15.88,39.44 15.31,40.01 13.97,40.01 6.99,33.02 6.99,28.47 v5.51,27
BOOT0  (via drill 0.35)
  Top 0.305: v31.27,27.11 31.69,26.69 STM32F103CB.44 31.69,24.83 33.83,22.68 33.84,22.68 35.14,21.38 35.14,18.65 36.09,17.7 36.09,14.77 R15.2 38.1,12.76 38.1,6.99 39.42,5.66 SW1.2
BOOT1
  Top 0.305: 36.88,4.02 SW1.1 36.88,8.2 34.54,10.54 34.54,12.7 34.54,12.83 34.54,13.98 R11.2 33.19,14.71 STM32F103CB.20
FRONT_LIGHT  (via drill 0.35)
  Top 0.305: v39.09,17.5 39.09,18.69 38.2,19.59 STM32F103CB.27
  Top 0.813: R18.1 76.81,3.3 v76.81,1.63
  Bottom 0.406: v39.09,17.5 39.09,18.69 38.05,19.73 38.05,20.39 38.48,20.82 39.09,20.82 40.38,19.53 45.26,19.53 50.49,24.77 70.89,24.77 74.3,21.36 74.3,4.14 v76.81,1.63
GND  (via drill 0.35)
  Top 0.254: 43.08,33.5 U1.9 | C17.2 50.17,30.48 47.32,30.48 | 47.32,30.48 46.13,30.48 45.88,30.73 U1.18 45.88,31.82 45.67,32.03 43.74,32.03 43.27,32.5 | Q8.2 48.03,27.33 48.03,27.53 47.32,28.24 47.32,30.48 | 40.69,30.43 41.94,31.67 41.91,31.7 41.91,32.33 42.07,32.5 U1.11 43.27,32.5 | 43.27,32.5 43.41,32.64 43.41,33.17 43.08,33.5 | 43.08,33.5 43.18,33.5 44.22,34.54 45.75,34.54 45.88,34.68 U1.1 45.88,36.79 48.26,39.17
  Top 0.305: 40.69,30.43 C21.2 | v34.72,15.16 34.69,15.2 STM32F103CB.23 34.69,21.19 33.66,22.23 31.75,22.23 | STM32F103CB.47 30.19,24.42 31.02,23.59 31.75,23.59 31.75,22.23 | STM32F103CB.8 30.11,20.59 31.75,22.23 | PI_HEADER.28 31.77,40.41 29.23,40.41 PI_HEADER.31 26.72,40.44 24.18,40.44 PI_HEADER.36 | C40.2 26.24,35.46 C37.1 | Q7.2 66.72,29.4 66.72,31.16 67.31,31.75 68.53,32.97 68.53,33.07 | PI_HEADER.22 40.84,41.71 42.14,40.41 | 42.14,40.41 46.86,40.41 48.11,39.17 48.26,39.17 PI_HEADER.15 49.55,40.41 52.09,40.41 PI_HEADER.12 54.63,40.46 57.23,40.46 PI_HEADER.8 59.69,40.49 64.77,40.49 PI_HEADER.1 66.47,39.17 68.3,41 C10.- | STM32F103CB.35 38.01,23.59 v38.38,23.22 | C1.2 36.85,36.35 38.26,36.35 40.02,38.1 41.27,38.1 42.14,38.96 42.14,40.41 | C38.2 v37.92,25 v37.92,24.99
  Top 0.406: Q8.2 47.12,25.93 45.54,25.93 Q6.2 | IC3.15 58.6,13.82 58.91,13.5 U5.4 58.91,11.47 59.35,11.04 | 61.99,24.11 R10.1 62.02,22.57 v62.03,22.55 | 7.23,22.54 6.92,22.23 | U2.7 9.2,26.98 8.89,26.67 | 8.89,26.67 8.55,27.01 U2.8 | U2.3 9.85,25.71 8.89,26.67 | 8.89,26.67 8.51,26.29 8.11,26.29 8.06,26.23 | R35.1 8.06,26.23 | 8.06,26.23 v7.29,27 | C2.2 70.61,32.38 69.22,32.38 68.53,33.07 IRLML1.2 | C34.- 18.82,33.25 19.05,33.02 22.5,33.02 24.82,35.33 C37.1 | C33.2 24.74,12.47 C7.2 24.33,12.07 29.59,12.07 | R11.1 32.45,14.38 30.16,14.38 29.59,13.81 29.59,12.07 | 29.59,12.07 29.59,10.44 31.24,8.79 U$10.OUT- | v60.17,22.53 59.54,22.53 59.24,22.23
  Top 0.508: PCA9533.4 12.69,33.02 v11.43,33.02
  Top 0.61: IC3.7 IC3.6 | IC3.6 IC3.5 | IC3.5 IC3.4 IC3.17 | IC3.14 54,12.7 | 54,12.7 IC3.15 | IC3.15 IC3.16 | IC3.17 IC3.16 | IC3.7 53.85,12.55 54,12.7 | IC3.15 IC3.6 | IC3.5 IC3.16 | IC2.7 IC2.14 IC2.15 | IC2.6 IC2.15 | IC2.5 IC2.16 | IC2.4 IC2.17 IC2.16 | IC2.7 IC2.6 | IC2.6 IC2.5 | IC2.5 IC2.4 | IC2.16 IC2.15 | C6.- 59.05,20.32 57.78,19.05 57.15,19.05 55.88,17.78 55.88,17.14 55.09,16.36 IC3.17 | IC2.7 60.86,12.55 59.35,11.04 59.08,10.77 C12.- | LDIAR.P4 72.72,24.04 72.62,24.13 | Q7.2 65.72,28.51 v64.74,29.49 | C34.- 19.52,34.27 | C37.1 27.99,38.64 PI_HEADER.31 | C38.2 35.43,29.64 C20.2 | C39.2 44.41,26.91 Q6.2 | C17.2 57.45,32.23 Q4.2 | R15.1 39.99,15.56 40.44,16 40.44,16.46 C3.- 40.95,16.36 41.91,16.36 v41.91,15.24 41.91,13.39 42.75,12.55 IC3.7 | R30.2 27.2,29.51 C40.2 | IC2.4 60.48,16.36 59.69,17.14 59.69,17.87 59.71,17.89 59.71,18.58 59.69,18.61 59.69,20.32 | v33.58,12.12 R11.1 | R14.1 54.34,23.59 v54.33,23.6
  Top 0.813: C9.2 59.24,22.23 59.24,20.35 C6.- | IRLML1.2 69.56,34.99 69.56,35.55 69.57,35.56 69.57,40.87 C10.- | C2.2 72.52,26.64 C14.- 72.62,24.13 72.62,22.33 C11.2 | C5.2 C8.2 15.87,3.68 U$10.IN- | C43.- 13.97,36.52 v13.97,35.84 14.88,34.92 17.63,34.92 18.29,34.27 C34.- 18.82,22.83 C36.1 | IC1.3 18.88,11.26 17.5,9.88 v17.5,8.97
  Top 1.016: C43.- 13.34,38.33 IRLML2502.2 | SUPPLY_IN1.1 4.45,9.63 C27.- | SUPPLY_IN.1 6.92,19.73 6.92,22.23 R35.1
  Top 1.27: C4.2 C5.2
  Top 1.524: C1.2 C18.2 C20.2
  Top 1.778: SUPPLY_IN.1 7.21,15.75 7.21,12.4 SUPPLY_IN1.1 8.26,7.09 C16.2
  Bottom 0.305: 35.56,15.24 35.56,20.4 v38.38,23.22 38.38,24.54 v37.92,24.99
  Bottom 0.406: v62.03,22.55 60.2,22.55 v60.17,22.53 55.4,22.53 v54.33,23.6
  Bottom 0.61: v41.91,15.24 35.56,15.24 34.8,15.24 v34.72,15.16 34.72,13.26 v33.58,12.12 | LDIAR.P4 75.27,24.04 74.95,23.72 74.95,13.95 75.22,13.68 FRONTLIGHT.P2
  Bottom 0.813: v7.29,27 8.43,27 C23.2 C24.2 8.76,30.98 10.79,33.02 v11.43,33.02 13.97,35.56 v13.97,35.84 | v17.5,8.97 17.5,4.09 17.78,3.81 17.78,3.56
  Bottom 2.54: SUPPLY_IN1.1 11.79,3.56 U$10.IN- 17.78,3.56 U$10.OUT-
LIDAR_POS_INT  (via drill 0.35)
  Top 0.305: STM32F103CB.25 37.8,18.59 37.97,18.41 37.97,17.53 v37.95,17.5
  Bottom 0.406: LDIAR.P3 71.43,26.04 70.9,25.5 50.27,25.5 44.98,20.22 40.66,20.22 39.42,21.46 38.12,21.46 37.39,20.73 37.39,19.36 37.95,18.8 v37.95,17.5
M_DIR_1  (via drill 0.35)
  Top 0.305: STM32F103CB.14 30.19,15.58 29.44,14.83 v28.12,14.83
  Top 0.406: 64.77,30.48 v64.77,31.75
  Top 0.813: R1.1 64.77,30.48 R9.1
  Bottom 0.406: v64.77,31.75 60.33,31.75 57.69,34.39 56.21,34.39 53.5,31.67 49.93,31.67 49.5,31.24 39.67,31.24 30.2,21.78 30.2,15.6 29.44,14.83 v28.12,14.83
M_DIR_2  (via drill 0.35)
  Top 0.305: STM32F103CB.15 30.69,15.67 v31.17,15.19
  Top 0.406: 51.44,28.96 51.21,29.19 v51.21,30.12
  Top 0.61: R13.1 51.44,28.96 R5.1
  Bottom 0.406: v51.21,30.12 40.13,30.12 32.33,22.33 32.33,18.36 31.17,17.2 v31.17,15.19
N$1  (via drill 0.35)
  Top 0.406: Q7.3 67.53,25.36 R4.1 67.53,21.38 v67.94,20.96
  Top 0.61: IC2.9 IC2.12 72.72,10.01 73.25,10.54 v73.25,19.13
  Bottom 0.406: v67.94,20.96 69.77,19.13 v73.25,19.13
N$2  (via drill 0.35)
  Top 0.813: IC3.18 v49.38,17.63
  Bottom 0.813: v49.38,17.63 49.38,7.77 50.8,6.35 52.07,6.35 52.41,6 ML2.P2
N$3  (via drill 0.35)
  Top 0.813: IC3.13 v50.7,11.28
  Bottom 0.813: ML2.P1 54.41,6.06 52.68,7.8 51.4,7.8 50.7,8.5 v50.7,11.28
N$4  (via drill 0.35)
  Top 0.813: IC2.18 v68.15,17.63
  Bottom 0.813: v68.15,17.63 68.15,9.32 70.83,6.64 MR2.P2
N$5
  Top 0.406: Q2.3 63.66,25.41 R10.2 65.41,22.44 65.41,18.9
  Top 0.61: IC2.19 67.31,18.9 65.41,18.9 IC2.2
N$6  (via drill 0.35)
  Top 0.406: Q8.3 49.21,24.87 R8.1 49.21,21.22 v49.15,21.16
  Top 0.61: IC3.9 IC3.12 v55.96,10.01
  Bottom 0.406: v55.96,10.01 52.7,13.26 52.7,20.32 51.87,21.16 v49.15,21.16
N$7
  Top 0.406: R14.2 52.64,23.43 52.98,23.77 Q5.3 | 52.55,22.31 R14.2 | R14.2 52.64,22.16 52.07,21.59 52.07,18.9
  Top 0.61: IC3.2 52.07,18.9 IC3.19
N$8  (via drill 0.35)
  Top 0.406: R7.1 59.48,26.04 60.33,26.04 60.96,25.4 60.96,20.14 60.98,20.12 61.04,20.17 62.23,20.17
  Top 0.61: IC2.1 62.23,20.17 v64.14,20.17 | IC2.11 v64.14,8.74 | R7.1 59.05,28.16 Q4.3
  Bottom 0.61: v64.14,20.17 v64.14,8.74
N$9  (via drill 0.35)
  Top 0.406: Q6.3 45.36,22.44 R12.1 45.4,20.18 45.41,20.17
  Top 0.61: IC3.1 45.41,20.17 v50.7,20.17 | IC3.11 v51.79,8.74
  Bottom 0.61: v50.7,20.17 51.79,19.07 v51.79,8.74
N$10
  Top 0.406: R1.2 63.72,28.78 63.72,28.51
  Top 0.61: 63.72,28.51 Q2.1
N$11
  Top 0.406: R2.2 59.91,31.68
  Top 0.61: Q4.1 59.91,31.68
N$12
  Top 0.406: R9.2 67.62,30.38 67.62,28.63
  Top 0.61: 67.62,28.63 Q7.1
N$13
  Top 0.61: Q5.1 53.93,28.86 R5.2
N$14
  Top 0.61: R6.2 46.21,27.16 Q6.1
N$15
  Top 0.61: Q8.1 48.38,28.88 R13.2
N$16  (via drill 0.35)
  Top 0.813: IC2.13 v69.39,11.28
  Bottom 0.813: MR2.P1 72.83,6.54 69.39,9.98 v69.39,11.28
N$17  (via drill 0.35)
  Top 0.813: IC2.8 v65.63,11.28
  Bottom 0.813: v65.63,11.28 65.63,8.48 63.84,6.69 MR1.P2
N$18  (via drill 0.35)
  Top 0.61: 66.9,17.63 v66.93,17.65
  Top 0.813: IC2.3 66.9,17.63
  Bottom 0.813: v66.93,17.65 66.93,7.87 65.84,6.79 MR1.P1
N$19
  Top 0.813: R18.2 76.79,6.18 Q9.1
N$22
  Top 0.508: PCA9533.3 13.98,34.28 13.34,34.92 R26.1
N$23
  Top 0.508: PCA9533.2 15.25,31.76 14.61,31.12 11.01,31.12 R27.1
N$24
  Top 0.508: PCA9533.1 16.51,31.75 14.61,29.84 R28.1
N$25  (via drill 0.35)
  Top 0.813: IC3.8 v47.02,11.28
  Bottom 0.813: v47.02,11.28 45.43,9.69 ML1.P2
N$26  (via drill 0.35)
  Top 0.813: IC3.3 v48.11,17.63
  Bottom 0.813: ML1.P1 47.43,7.12 48.11,7.8 v48.11,17.63
N$27
  Top 0.813: R3.1 78.89,18.32 78.89,12.45 Q9.2
N$28
  Top 0.813: FRONTLIGHT.P1 76.79,18.73 R3.2
N$31
  Top 0.508: R26.2 4.01,34.92 RGB_LED.P4
N$33
  Top 0.61: RGB_LED.P3 7.66,32.77 R27.2
N$34
  Top 0.305: U1.20 46.99,32.5 47.1,32.5 48.85,32.5 C17.1
N$35
  Top 0.61: R28.2 7.12,30.77 RGB_LED.P2
N$36
  Top 0.305: C21.1 41.02,33 U1.10
N$37
  Top 0.508: IRLML2502.3 12.42,41.4 14.31,41.4 R22.2
N$38
  Top 0.813: R38.2 68.52,35.88 IRLML1.3
N$39
  Top 0.813: LIDAR.P2 76.8,39.06 D1.A 74.97,33.02 71.75,33.02 70.56,34.21 IRLML1.1
N$46
  Top 0.305: STM32F103CB.6 23.43,21.59 23.42,21.59
  Top 0.406: C36.2 23.42,21.59 Q12.1
N$47
  Top 0.305: 24.29,32.55 C37.2 24.82,31.06 25.76,30.12 25.76,25.5 25.76,25.4 25.76,23.14 26.81,22.09 STM32F103CB.5
  Top 0.406: Q12.3 20.92,30.45 23.02,32.55 24.29,32.55
N$49
  Top 0.305: STM32F103CB.2 26.93,23.59 26.47,24.05 26.47,25.59 R30.1
N$55
  Top 1.016: IRLML2502.1 8.95,42.42 D3.A 8.89,42.36 8.1,41.56 FAN.P2
NRST  (via drill 0.35)
  Top 0.305: STM32F103CB.7 25.99,21.09 v25.6,20.7
  Bottom 0.305: PI_HEADER.26 34.27,40.36 34.27,38.3 32.79,36.83 28.57,36.83 27.3,35.56 27.3,22.4 v25.6,20.7
PWM_FAN  (via drill 0.35)
  Top 0.305: STM32F103CB.18 v32.19,15.19 v32.18,15.19
  Top 0.406: R22.1 v15.01,39.27
  Bottom 0.406: v32.18,15.19 31.9,14.91 31.9,14.89 31.32,14.31 30.09,14.31 29.86,14.07 20.09,14.07 17.25,16.92 17.25,21.6 17.22,22 15.01,24.21 v15.01,39.27
PWM_LIDAR  (via drill 0.35)
  Top 0.305: STM32F103CB.19 32.69,18.08 33.02,18.41 v33.66,18.41
  Top 0.406: R38.1 66.67,34.2 | 66.59,34.29 66.67,34.2 | 66.67,34.2 v66.67,32.38
  Bottom 0.406: v33.66,18.41 34.29,19.05 34.29,22.71 39.88,28.3 43.48,28.3 44.4,29.21 53.34,29.21 54.61,30.48 66.04,30.48 66.67,31.12 v66.67,32.38
PWM_M_EN_1  (via drill 0.35)
  Top 0.305: STM32F103CB.16 31.19,19.32 v31.19,19.79
  Top 0.406: R2.1 v56.52,33.66
  Bottom 0.406: v56.52,33.66 53.98,31.12 50.16,31.12 49.73,30.68 39.9,30.68 31.19,21.98 31.19,20.04 v31.19,19.79
PWM_M_EN_2  (via drill 0.35)
  Top 0.305: v33.35,19.56 32.56,19.56 31.69,18.68 STM32F103CB.17
  Top 0.406: R6.1 43.2,29.01 v43.18,29.03
  Bottom 0.406: v43.18,29.03 39.83,29.03 33.35,22.55 v33.35,19.56
SCL  (via drill 0.35)
  Top 0.305: STM32F103CB.42 32.69,26.69 v33.25,27.25 | U1.23 47.66,34 48.79,35.13 v48.79,36.4 | 19.46,16.48 21.48,16.48 R29.2
  Top 0.406: U2.5 10.5,26.97 11.1,26.37 11.1,24.18 12.37,22.91 14.2,22.91 19.05,18.06 19.05,16.9 19.46,16.48 | v22.33,18.9 R29.2
  Top 0.508: PCA9533.6 13.97,24.89 19.43,19.43 21.79,19.43 v22.33,18.9
  Bottom 0.406: v48.79,36.4 42.39,36.4 v33.25,27.25 33.25,25.62 29.21,21.58 29.21,17.14 27.3,15.24 24.77,15.24 22.33,17.68 v22.33,18.9 22.38,18.9
SDA  (via drill 0.35)
  Top 0.305: STM32F103CB.43 v32.19,27.6 v32.19,27.61 | U1.24 47.2,34.5 47.83,35.13 v47.83,37.49
  Top 0.406: R20.2 v20.17,18.57 19.43,18.57 14.51,23.5 12.7,23.5 11.73,24.46 11.73,28.73 | U2.6 9.85,28.44 10.13,28.73 11.73,28.73 | PCA9533.7 15.24,28.19 14.71,28.73 11.73,28.73
  Bottom 0.406: v47.83,37.49 42.07,37.49 v32.19,27.61 32.19,25.34 28.63,21.78 28.63,17.53 26.98,15.88 25.15,15.88 23.5,17.53 23.5,18.97 22.78,19.69 21.29,19.69 v20.17,18.57
SWCLK
  Top 0.305: STM32F103CB.37 35.19,26.79 33.25,28.73 33.25,36.27 34.44,37.47 35.56,37.47 36.83,38.73 36.83,42.14 37.87,43.18 41.76,43.18 PI_HEADER.20
SWDIO
  Top 0.305: 33.93,35.84 33.91,35.84 | 33.91,35.84 33.91,28.96 35.71,27.15 35.71,23.32 35.94,23.09 STM32F103CB.34 | 33.91,35.84 34.87,36.8 38.08,36.8 39.45,38.18 39.45,40.41 PI_HEADER.24
TEMPERATURE  (via drill 0.35)
  Top 0.305: STM32F103CB.28 v38.78,20.09 v38.79,20.09 40.04,18.83 R25.1
  Top 0.406: U5.1 56.96,10.78 v56.97,10.77
  Bottom 0.406: v56.97,10.77 56.97,19.86 54.53,22.3 49.12,22.3 45.57,18.75 40.13,18.75 v38.79,20.09
U1_RX  (via drill 0.35)
  Top 0.305: STM32F103CB.31 38.12,21.59 v39.12,22.58
  Bottom 0.61: LDIAR.P1 71.11,30.04 68.76,27.69 49.71,27.69 44.88,22.86 39.4,22.86 v39.12,22.58
U1_TX  (via drill 0.35)
  Top 0.305: v40.64,21.59 40.14,21.09 STM32F103CB.30
  Bottom 0.61: LDIAR.P2 70.58,28.04 69.22,26.67 50.16,26.67 45.09,21.59 v40.64,21.59
USART2_RX  (via drill 0.35)
  Top 0.305: STM32F103CB.13 29.69,15.84 29.49,15.65 28.42,15.65 v26.39,17.65
  Bottom 0.305: PI_HEADER.34 25.45,41.33 24.13,40.01 24.13,38.73 26.04,36.83 26.04,23.72 24.11,21.79 24.11,19.96 v26.39,17.65
USART2_TX  (via drill 0.35)
  Top 0.305: STM32F103CB.12 v26.6,18.59 v26.59,18.59
  Bottom 0.305: PI_HEADER.32 26.7,40.41 26.7,23.51 24.77,21.58 24.77,20.32 26.49,18.59 v26.59,18.59
V+
  Top 0.406: 9.53,3.68 9.82,3.98 9.86,4.01 9.86,11.73 8.55,13.04 U2.1
  Top 0.813: 4.65,21.39 SUPPLY_IN.2
  Top 1.016: R34.2 1.79,24.67 SUPPLY_IN.2
  Top 1.778: SUPPLY_IN.2 2.54,18.84 2.54,16.3 SUPPLY_IN1.2 1.91,10.59 1.91,4.44 2.69,3.66 C27.+ 4.47,3.68 C16.1 9.53,3.68 R17.2
(copper drawn outside any net)
  shapes: Top area x8, Top circle x1